# Altium schematic sheet OSCILADOR-SENSOR.SchDoc: Oscilador de YIG sensor
size A4; Author: Mario de Miguel; DrawnBy: Mario de Miguel; Engineer: Mario de Miguel; Revision: 1; SheetNumber: 2; SheetTotal: 3; SPICEModelCacheWSRTSYKR: <root> / <DocumentId>WSRTSYKR</DocumentId> / </root>; ProjectTitle: SWSH-Cross
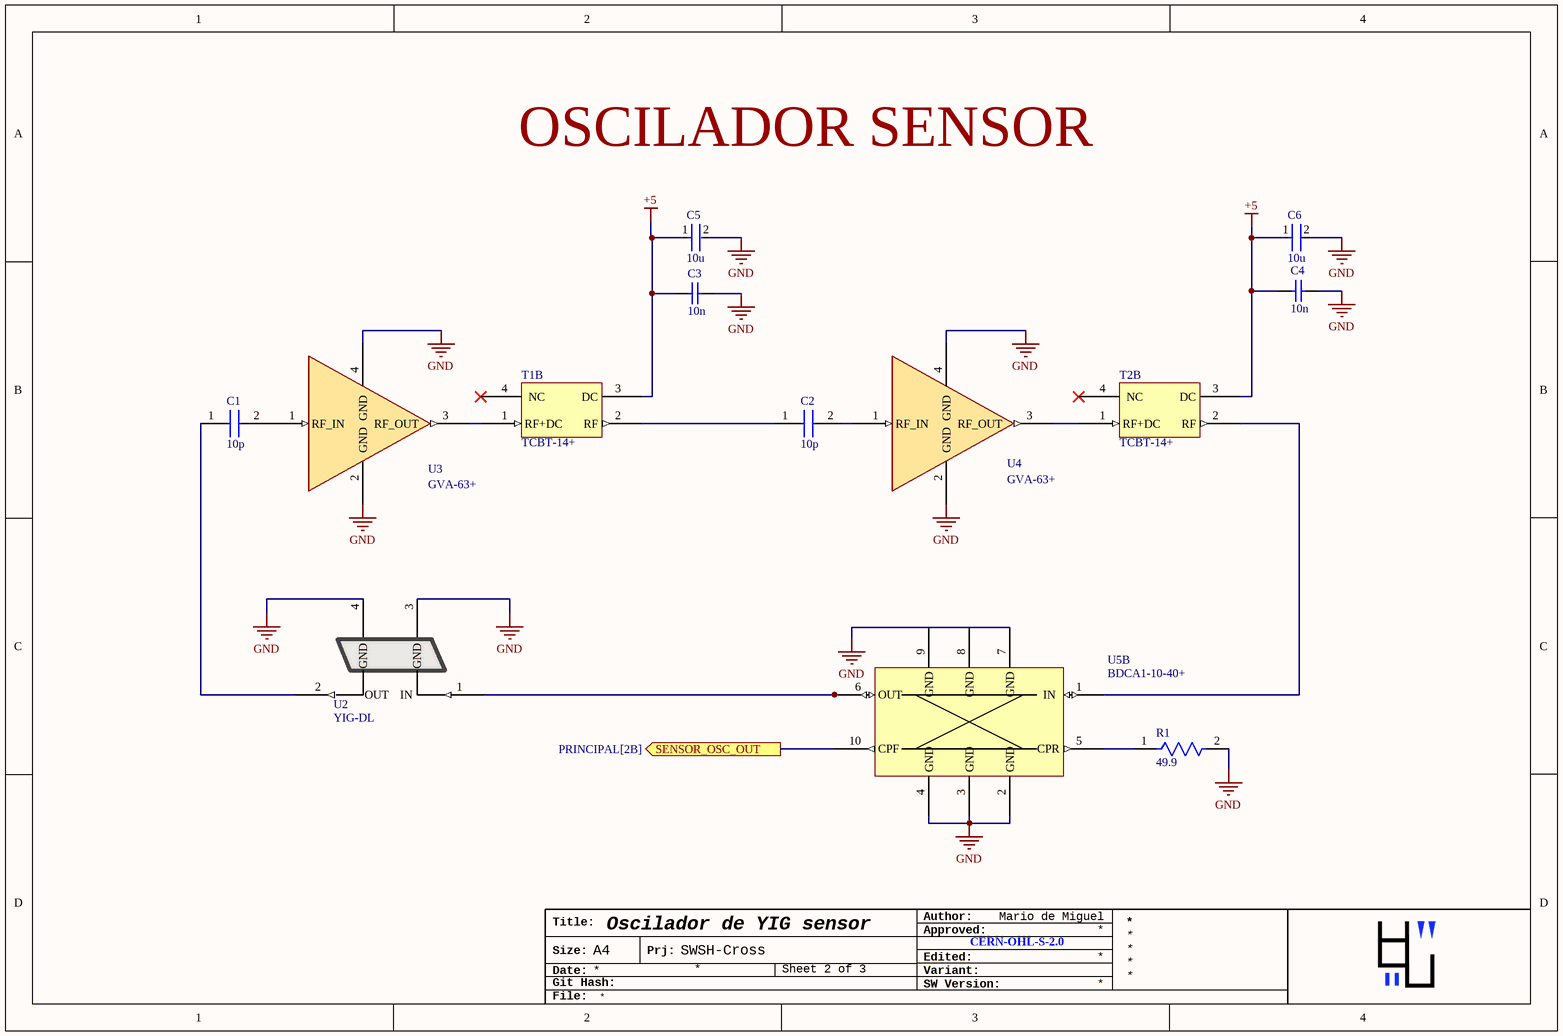
[diagram p0: OSCILADOR-SENSOR.SchDoc]

## Parts
C1  10p  [GRM1555C2A100FA01D]
C2  10p  [GRM1555C2A100FA01D]
C3  10n  [CAPC1608X90X35LL10T15]
C4  10n  [CAPC1608X90X35LL10T15]
C5  10u  [FP-GRM21B-0_1-MFG]
C6  10u  [FP-GRM21B-0_1-MFG]
R1  49.9  [FP-RNCP0603-IPC_C]
T1  TCBT-14+  [PL321-GU1414-TCBT-14+]  (part B of 2)
T2  TCBT-14+  [PL321-GU1414-TCBT-14+]  (part B of 2)
U2  YIG-DL  [YIG_DL_5mm-C]
U3  GVA-63+  [DF782-GVA-63+]
U4  GVA-63+  [DF782-GVA-63+]
U5  BDCA1-10-40+  [PL400-DZ944-BDCA1-10-40]  (part B of 2)

## Ports
SENSOR_OSC_OUT (out, see PRINCIPAL[2B])

## Nets
+5: C3.2 C4.2 C5.1 C6.1 T1.3(DC) T2.3(DC)
GND: C3.1 C4.1 C5.2 C6.2 R1.2 U2.3(GND) U2.4(GND) U3.2(GND) U3.4(GND) U4.2(GND) U4.4(GND) U5.2(GND) U5.3(GND) U5.4(GND) U5.7(GND) U5.8(GND) U5.9(GND)
SENSOR_OSC_OUT: U5.10(CPF) ; port SENSOR_OSC_OUT
NetC1_1: C1.1 U2.2(OUT)
NetC1_2: C1.2 U3.1(RF_IN)
NetC2_1: C2.1 T1.2(RF)
NetC2_2: C2.2 U4.1(RF_IN)
NetR1_1: R1.1 U5.5(CPR)
NetT1_1: T1.1(RF+DC) U3.3(RF_OUT)
NetT2_1: T2.1(RF+DC) U4.3(RF_OUT)
NetT2_2: T2.2(RF) U5.1(IN)
NetU2_1: U2.1(IN) U5.6(OUT)

Not connected (* = marked no-connect by the designer): T1 4(NC)*; T2 4(NC)*

## Notes on the sheet
- OSCILADOR SENSOR
- Title:
- Author:
- Approved:
- Size:
- Date:
- Git Hash:
- A4
- Prj:
- SW Version:
- Variant:
- Edited:
- CERN-OHL-S-2.0
- File:

## Library data of the parts
C1 C2 = GRM1555C2A100FA01D
C3 C4 = CMP-2006-02373-1: Part Number: GCM188R71H103KA37D; Manufacturer: Murata
C5 C6 = CMP-2007-03534-2: Chip Multilayer Ceramic Capacitors for General Purpose, 0805, 10uF, X5R, 15%, 10%, 16V; Case Code (Imperial): 0805; Packaging: Tape and Reel; Width: 0.049inch; Depth: 1.25mm; Voltage Rating: 16V; Height: 1.25mm; Case/Package: 0805; Max Operating Temperature: 85°C; Min Operating Temperature: -55°C; Tolerance: 10%; Dielectric: X5R; REACH SVHC: No SVHC; Mount: Surface Mount; Radiation Hardening: No; Case Code (Metric): 2012; Length: 2mm; Package Quantity: 10000; Voltage Rating (DC): 16V; Voltage: 16V; Capacitance: 10uF; Thickness: 0.053inch; Termination: SMD/SMT
R1 = CMP-26527-005229-1: 49.9Ω ±1% 0.125W 0603 High Power Anti-Sulfur Thin Film Chip Resistor; Temperature Coefficient: 100ppm/°C; Resistance: 49.9R; Max Power Dissipation: 125mW; Max Operating Temperature: 155°C; Resistor Type: Thin Film; Case Code (Metric): 1608; Case/Package: 0603; Tolerance: 1%; Length: 0.059inch; Mount: Surface Mount; Case Code (Imperial): 0603; Features: Moisture Resistant; Series: RNCP; Height: 0.02inch; Min Operating Temperature: -55°C; Number of Terminations: 2; Packaging: Cut Tape; Width: 0.031inch; Lead Free: Lead Free; RoHS Compliant: Yes